# EAGLE schematic ccnor_stm32_v25-sync-unified-mini_panels (EAGLE 6.1)
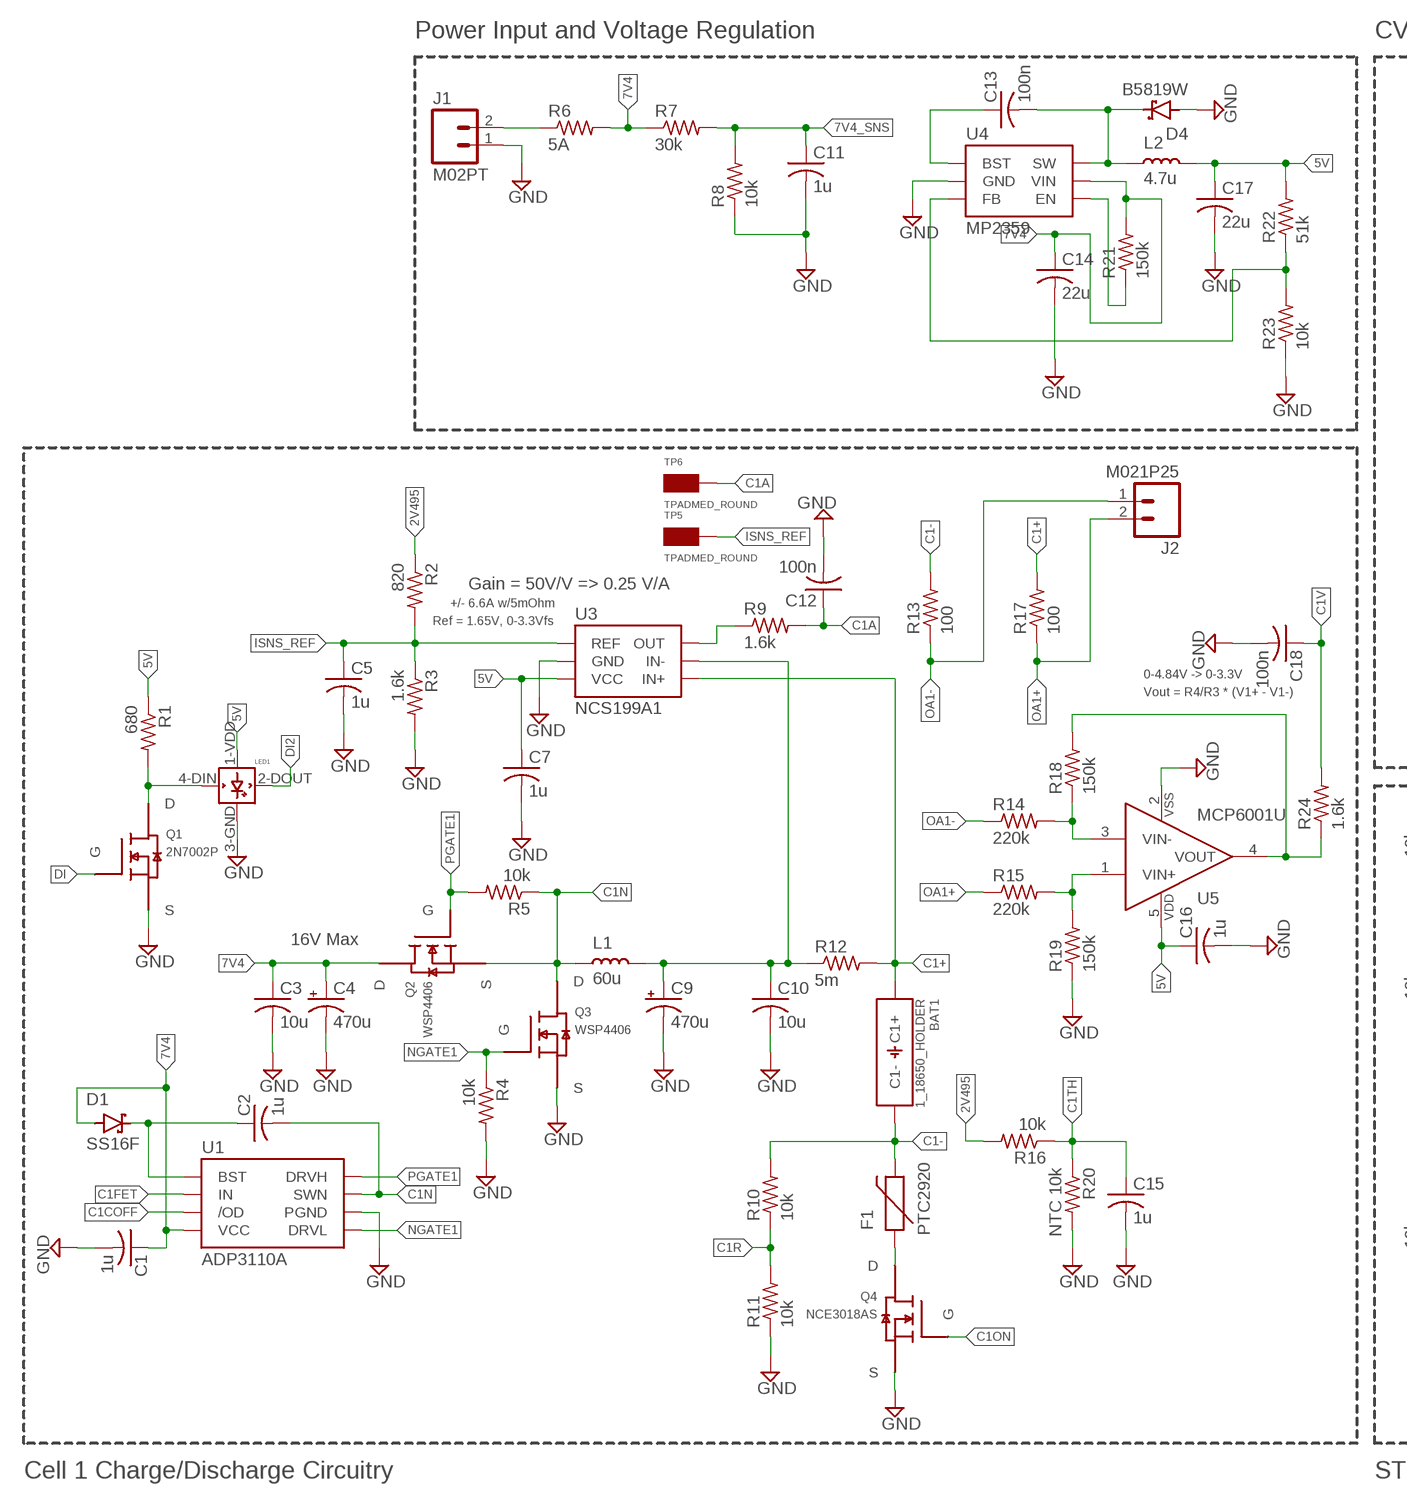
[diagram p0: schematic, sheet 1, part 1 of 3]
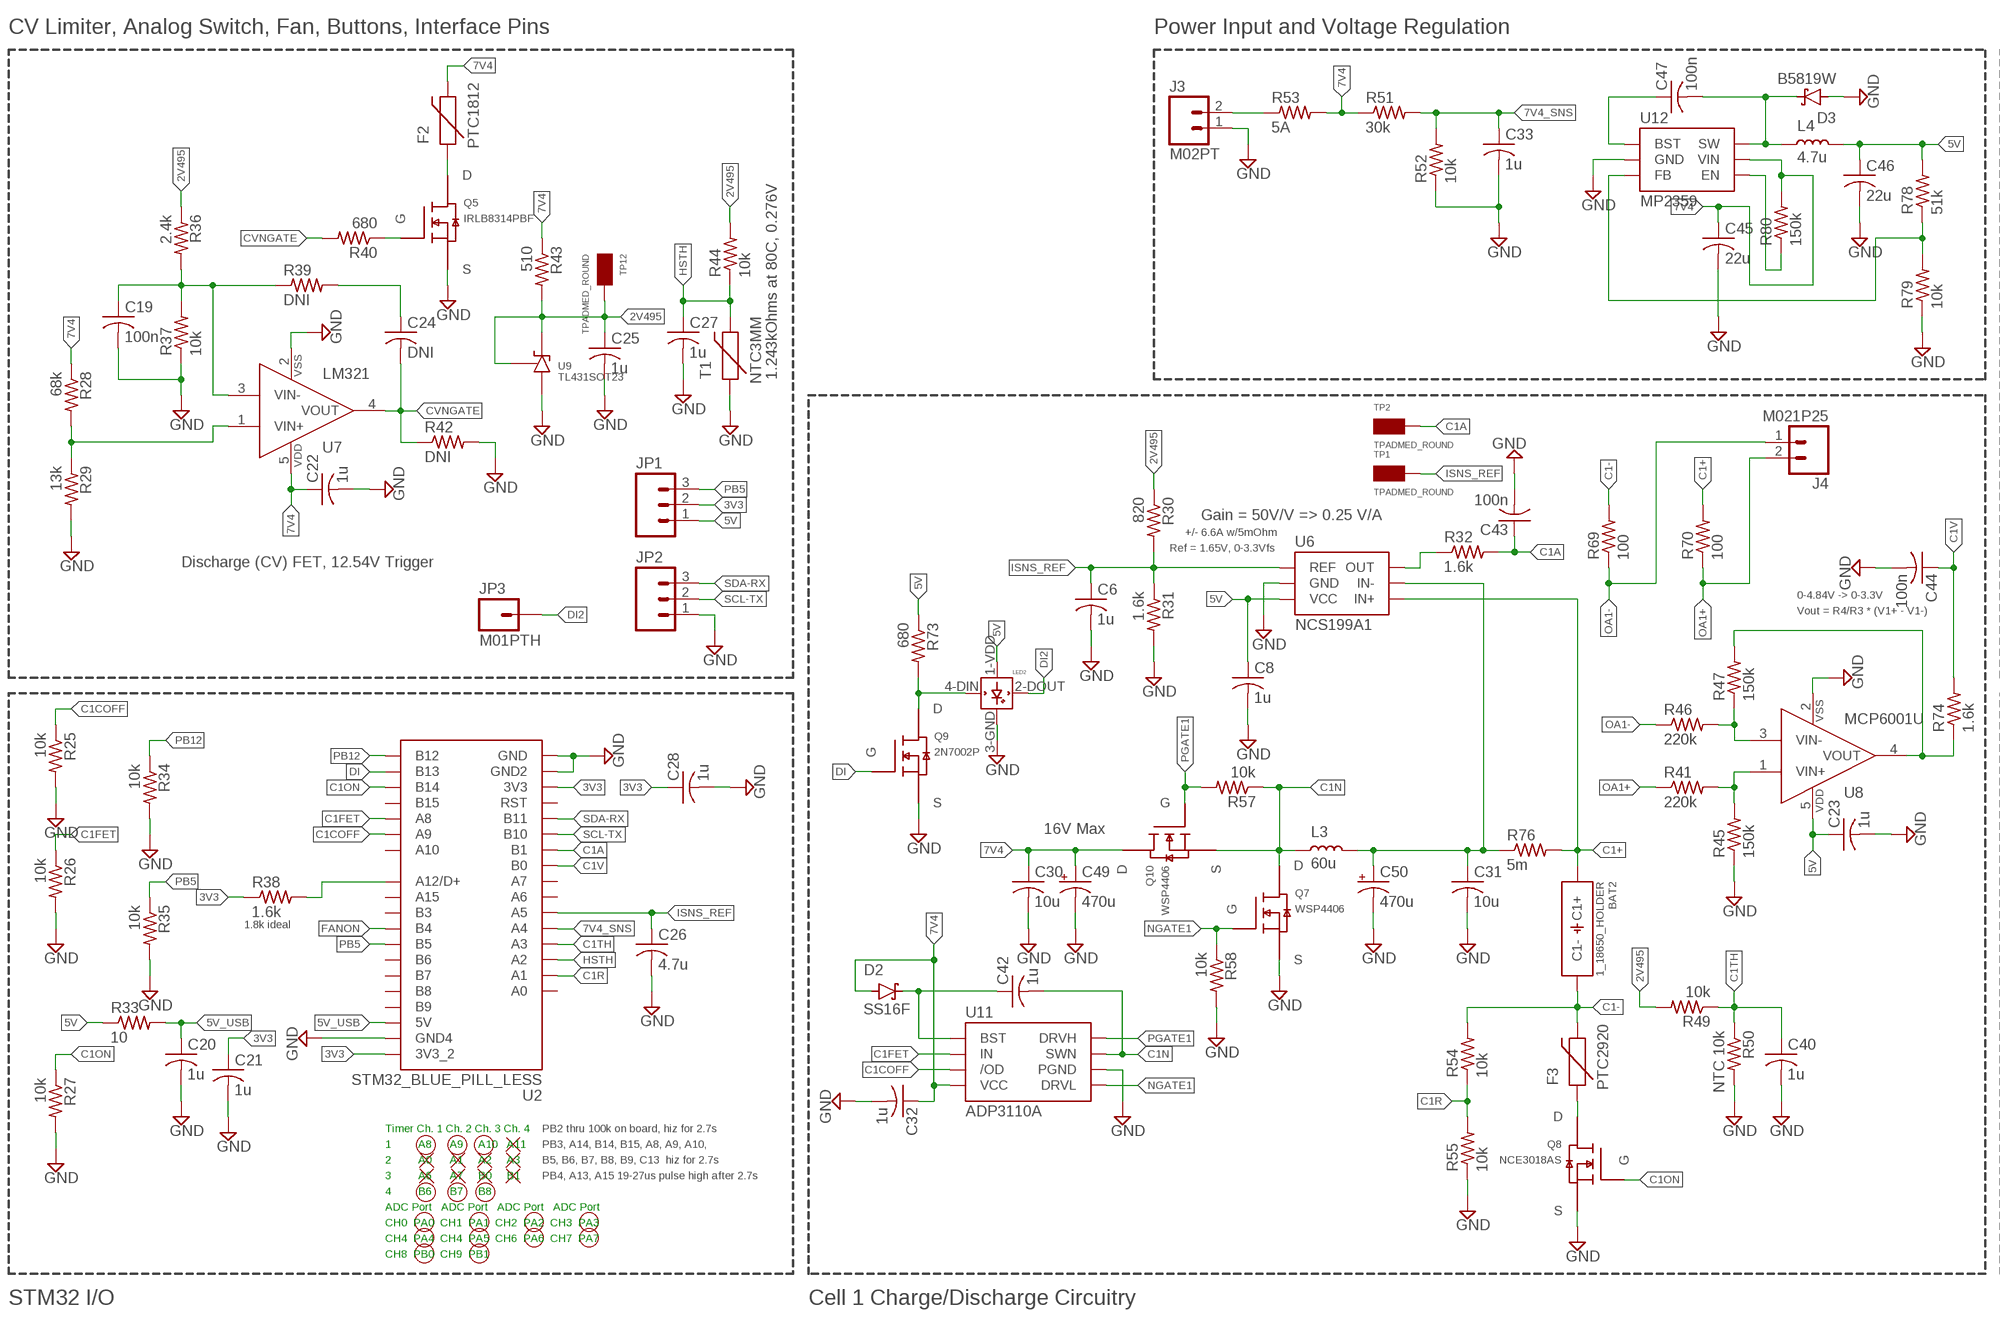
[diagram p1: schematic, sheet 1, part 2 of 3]
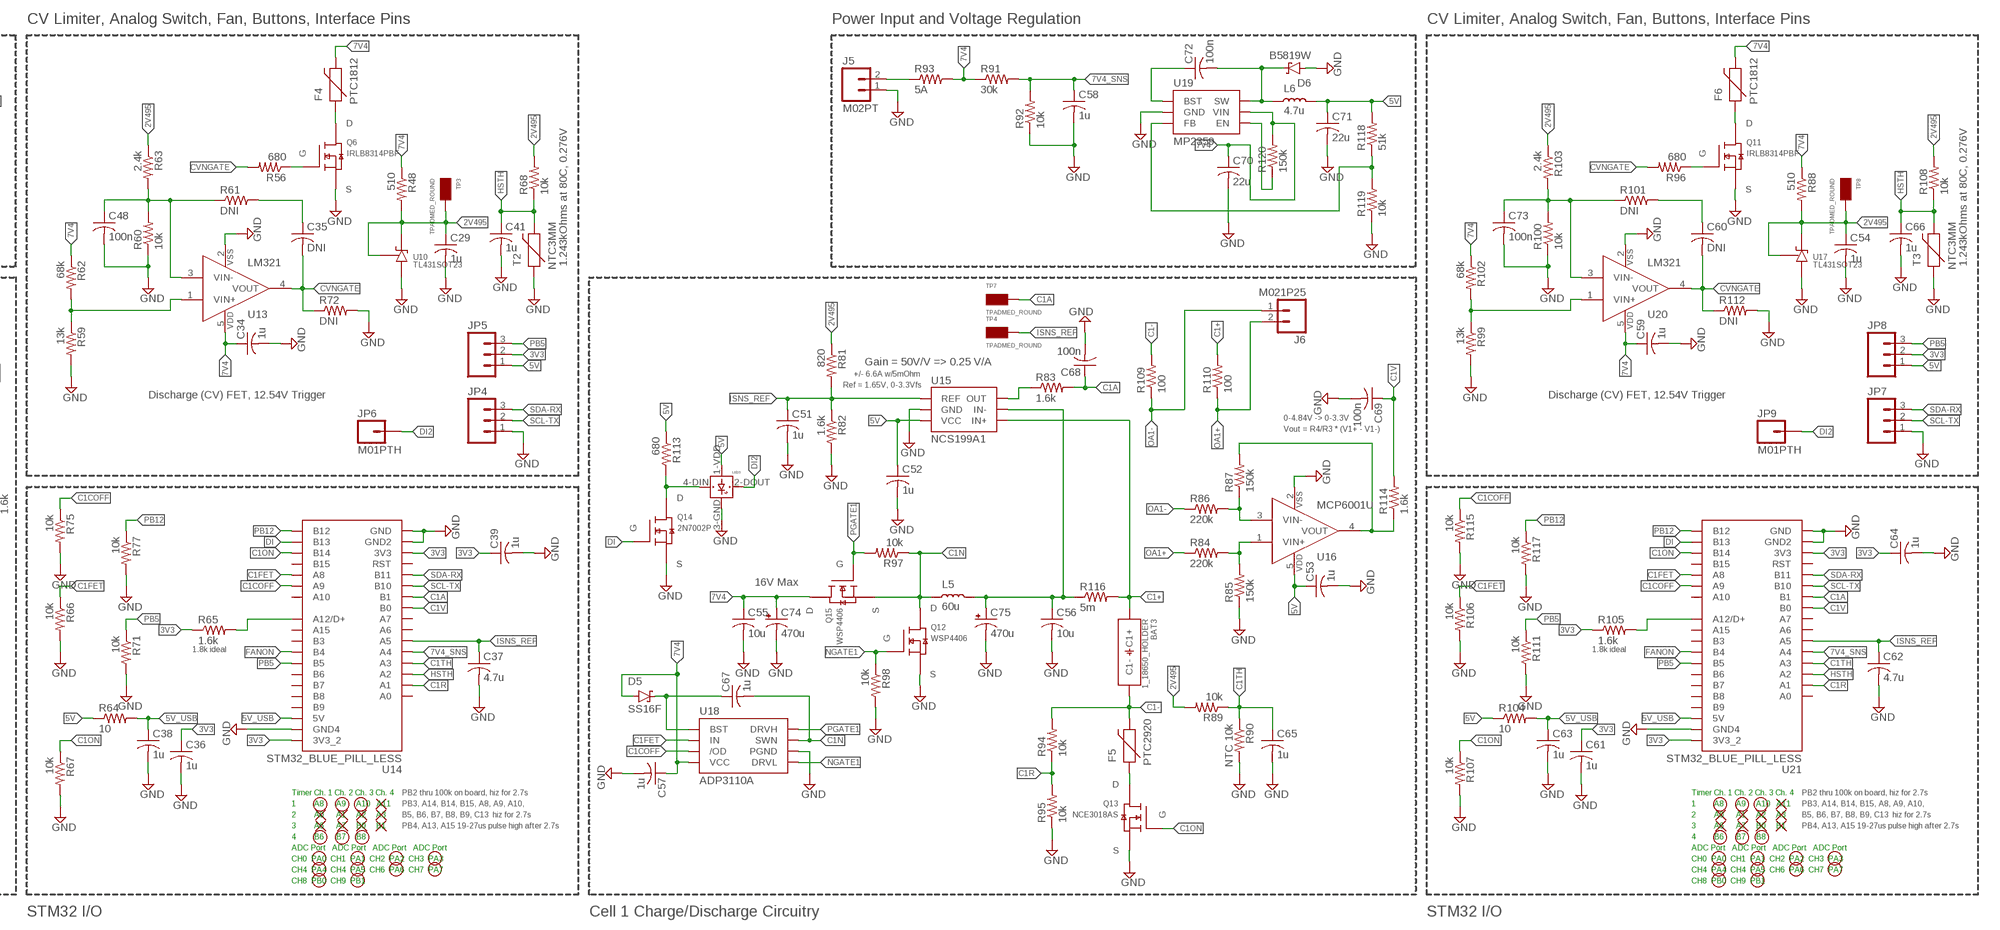
[diagram p2: schematic, sheet 1, part 3 of 3]

## Parts
BAT1  1_18650_HOLDER  [1S_18650_SMD_NH]
BAT2  1_18650_HOLDER  [1S_18650_SMD_NH]
BAT3  1_18650_HOLDER  [1S_18650_SMD_NH]
C1  1u  C-USC0402  [C0402]
C2  1u  C-USC0603  [C0603]
C3  10u  C-USC1206  [C1206]
C4  470u  CPOL-USE2.5-7  [E2,5-7]
C5  1u  C-USC0402  [C0402]
C6  1u  C-USC0402  [C0402]
C7  1u  C-USC0402  [C0402]
C8  1u  C-USC0402  [C0402]
C9  470u  CPOL-USE2.5-7  [E2,5-7]
C10  10u  C-USC1206  [C1206]
C11  1u  C-USC0402  [C0402]
C12  100n  C-USC0402  [C0402]
C13  100n  C-USC0402  [C0402]
C14  22u  C-USC0805  [C0805]
C15  1u  C-USC0402  [C0402]
C16  1u  C-USC0402  [C0402]
C17  22u  C-USC0603  [C0603]
C18  100n  C-USC0402  [C0402]
C19  100n  C-USC0402  [C0402]
C20  1u  C-USC0402  [C0402]
C21  1u  C-USC0402  [C0402]
C22  1u  C-USC0402  [C0402]
C23  1u  C-USC0402  [C0402]
C24  DNI  C-USC0402  [C0402]
C25  1u  C-USC0402  [C0402]
C26  4.7u  C-USC0402  [C0402]
C27  1u  C-USC0402  [C0402]
C28  1u  C-USC0402  [C0402]
C29  1u  C-USC0402  [C0402]
C30  10u  C-USC1206  [C1206]
C31  10u  C-USC1206  [C1206]
C32  1u  C-USC0402  [C0402]
C33  1u  C-USC0402  [C0402]
C34  1u  C-USC0402  [C0402]
C35  DNI  C-USC0402  [C0402]
C36  1u  C-USC0402  [C0402]
C37  4.7u  C-USC0402  [C0402]
C38  1u  C-USC0402  [C0402]
C39  1u  C-USC0402  [C0402]
C40  1u  C-USC0402  [C0402]
C41  1u  C-USC0402  [C0402]
C42  1u  C-USC0603  [C0603]
C43  100n  C-USC0402  [C0402]
C44  100n  C-USC0402  [C0402]
C45  22u  C-USC0805  [C0805]
C46  22u  C-USC0603  [C0603]
C47  100n  C-USC0402  [C0402]
C48  100n  C-USC0402  [C0402]
C49  470u  CPOL-USE2.5-7  [E2,5-7]
C50  470u  CPOL-USE2.5-7  [E2,5-7]
C51  1u  C-USC0402  [C0402]
C52  1u  C-USC0402  [C0402]
C53  1u  C-USC0402  [C0402]
C54  1u  C-USC0402  [C0402]
C55  10u  C-USC1206  [C1206]
C56  10u  C-USC1206  [C1206]
C57  1u  C-USC0402  [C0402]
C58  1u  C-USC0402  [C0402]
C59  1u  C-USC0402  [C0402]
C60  DNI  C-USC0402  [C0402]
C61  1u  C-USC0402  [C0402]
C62  4.7u  C-USC0402  [C0402]
C63  1u  C-USC0402  [C0402]
C64  1u  C-USC0402  [C0402]
C65  1u  C-USC0402  [C0402]
C66  1u  C-USC0402  [C0402]
C67  1u  C-USC0603  [C0603]
C68  100n  C-USC0402  [C0402]
C69  100n  C-USC0402  [C0402]
C70  22u  C-USC0805  [C0805]
C71  22u  C-USC0603  [C0603]
C72  100n  C-USC0402  [C0402]
C73  100n  C-USC0402  [C0402]
C74  470u  CPOL-USE2.5-7  [E2,5-7]
C75  470u  CPOL-USE2.5-7  [E2,5-7]
D1  SS16F  DIODE_SCHOTTKYCDBM140-G  [SOD123]
D2  SS16F  DIODE_SCHOTTKYCDBM140-G  [SOD123]
D3  B5819W  PMEG3020ER  [SOD123W]
D4  B5819W  PMEG3020ER  [SOD123W]
D5  SS16F  DIODE_SCHOTTKYCDBM140-G  [SOD123]
D6  B5819W  PMEG3020ER  [SOD123W]
F1  PTC2920  [2920]
F2  PTC1812  [1812]
F3  PTC2920  [2920]
F4  PTC1812  [1812]
F5  PTC2920  [2920]
F6  PTC1812  [1812]
J1  M02PT  [PHOENIXCONTACT1935161]
J2  M021P25  [M02_1P25MM]
J3  M02PT  [PHOENIXCONTACT1935161]
J4  M021P25  [M02_1P25MM]
J5  M02PT  [PHOENIXCONTACT1935161]
J6  M021P25  [M02_1P25MM]
JP1  M03PTH  [1X03]
JP2  M03PTH  [1X03]
JP3  M01PTH  [1X01]
JP4  M03PTH  [1X03]
JP5  M03PTH  [1X03]
JP6  M01PTH  [1X01]
JP7  M03PTH  [1X03]
JP8  M03PTH  [1X03]
JP9  M01PTH  [1X01]
L1  60u  INDUCTOR10A  [INDUCTOR_10A_8.2MMX21MM]
L2  4.7u  INDUCTOR0805  [0805]
L3  60u  INDUCTOR10A  [INDUCTOR_10A_8.2MMX21MM]
L4  4.7u  INDUCTOR0805  [0805]
L5  60u  INDUCTOR10A  [INDUCTOR_10A_8.2MMX21MM]
L6  4.7u  INDUCTOR0805  [0805]
LED1  WS2812B  [WS2812B]
LED2  WS2812B  [WS2812B]
LED3  WS2812B  [WS2812B]
Q1  2N7002P  [SOT23]
Q2  WSP4406  N-MOSFET-SOIC8  [8-SOIC]
Q3  WSP4406  N-MOSFET-SOIC8  [8-SOIC]
Q4  NCE3018AS  N-MOSFET-SOIC8  [8-SOIC]
Q5  IRLB8314PBF  [TO-220]
Q6  IRLB8314PBF  [TO-220]
Q7  WSP4406  N-MOSFET-SOIC8  [8-SOIC]
Q8  NCE3018AS  N-MOSFET-SOIC8  [8-SOIC]
Q9  2N7002P  [SOT23]
Q10  WSP4406  N-MOSFET-SOIC8  [8-SOIC]
Q11  IRLB8314PBF  [TO-220]
Q12  WSP4406  N-MOSFET-SOIC8  [8-SOIC]
Q13  NCE3018AS  N-MOSFET-SOIC8  [8-SOIC]
Q14  2N7002P  [SOT23]
Q15  WSP4406  N-MOSFET-SOIC8  [8-SOIC]
R1  680  R-US_R0402  [R0402]
R2  820  R-US_R0402  [R0402]
R3  1.6k  R-US_R0402  [R0402]
R4  10k  R-US_R0402  [R0402]
R5  10k  R-US_R0402  [R0402]
R6  5A  R-US_R1206  [R1206]
R7  30k  R-US_R0402  [R0402]
R8  10k  R-US_R0402  [R0402]
R9  1.6k  R-US_R0402  [R0402]
R10  10k  R-US_R0402  [R0402]
R11  10k  R-US_R0402  [R0402]
R12  5m  R-US_R1206  [R1206]
R13  100  R-US_R0402  [R0402]
R14  220k  R-US_R0402  [R0402]
R15  220k  R-US_R0402  [R0402]
R16  10k  R-US_R0402  [R0402]
R17  100  R-US_R0402  [R0402]
R18  150k  R-US_R0402  [R0402]
R19  150k  R-US_R0402  [R0402]
R20  NTC 10k  R-US_R0402  [R0402]
R21  150k  R-US_R0402  [R0402]
R22  51k  R-US_R0402  [R0402]
R23  10k  R-US_R0402  [R0402]
R24  1.6k  R-US_R0402  [R0402]
R25  10k  R-US_R0402  [R0402]
R26  10k  R-US_R0402  [R0402]
R27  10k  R-US_R0402  [R0402]
R28  68k  R-US_R0402  [R0402]
R29  13k  R-US_R0402  [R0402]
R30  820  R-US_R0402  [R0402]
R31  1.6k  R-US_R0402  [R0402]
R32  1.6k  R-US_R0402  [R0402]
R33  10  R-US_R0402  [R0402]
R34  10k  R-US_R0402  [R0402]
R35  10k  R-US_R0402  [R0402]
R36  2.4k  R-US_R0402  [R0402]
R37  10k  R-US_R0402  [R0402]
R38  1.6k  R-US_R0402  [R0402]
R39  DNI  R-US_R0402  [R0402]
R40  680  R-US_R0402  [R0402]
R41  220k  R-US_R0402  [R0402]
R42  DNI  R-US_R0402  [R0402]
R43  510  R-US_R0402  [R0402]
R44  10k  R-US_R0402  [R0402]
R45  150k  R-US_R0402  [R0402]
R46  220k  R-US_R0402  [R0402]
R47  150k  R-US_R0402  [R0402]
R48  510  R-US_R0402  [R0402]
R49  10k  R-US_R0402  [R0402]
R50  NTC 10k  R-US_R0402  [R0402]
R51  30k  R-US_R0402  [R0402]
R52  10k  R-US_R0402  [R0402]
R53  5A  R-US_R1206  [R1206]
R54  10k  R-US_R0402  [R0402]
R55  10k  R-US_R0402  [R0402]
R56  680  R-US_R0402  [R0402]
R57  10k  R-US_R0402  [R0402]
R58  10k  R-US_R0402  [R0402]
R59  13k  R-US_R0402  [R0402]
R60  10k  R-US_R0402  [R0402]
R61  DNI  R-US_R0402  [R0402]
R62  68k  R-US_R0402  [R0402]
R63  2.4k  R-US_R0402  [R0402]
R64  10  R-US_R0402  [R0402]
R65  1.6k  R-US_R0402  [R0402]
R66  10k  R-US_R0402  [R0402]
R67  10k  R-US_R0402  [R0402]
R68  10k  R-US_R0402  [R0402]
R69  100  R-US_R0402  [R0402]
R70  100  R-US_R0402  [R0402]
R71  10k  R-US_R0402  [R0402]
R72  DNI  R-US_R0402  [R0402]
R73  680  R-US_R0402  [R0402]
R74  1.6k  R-US_R0402  [R0402]
R75  10k  R-US_R0402  [R0402]
R76  5m  R-US_R1206  [R1206]
R77  10k  R-US_R0402  [R0402]
R78  51k  R-US_R0402  [R0402]
R79  10k  R-US_R0402  [R0402]
R80  150k  R-US_R0402  [R0402]
R81  820  R-US_R0402  [R0402]
R82  1.6k  R-US_R0402  [R0402]
R83  1.6k  R-US_R0402  [R0402]
R84  220k  R-US_R0402  [R0402]
R85  150k  R-US_R0402  [R0402]
R86  220k  R-US_R0402  [R0402]
R87  150k  R-US_R0402  [R0402]
R88  510  R-US_R0402  [R0402]
R89  10k  R-US_R0402  [R0402]
R90  NTC 10k  R-US_R0402  [R0402]
R91  30k  R-US_R0402  [R0402]
R92  10k  R-US_R0402  [R0402]
R93  5A  R-US_R1206  [R1206]
R94  10k  R-US_R0402  [R0402]
R95  10k  R-US_R0402  [R0402]
R96  680  R-US_R0402  [R0402]
R97  10k  R-US_R0402  [R0402]
R98  10k  R-US_R0402  [R0402]
R99  13k  R-US_R0402  [R0402]
R100  10k  R-US_R0402  [R0402]
R101  DNI  R-US_R0402  [R0402]
R102  68k  R-US_R0402  [R0402]
R103  2.4k  R-US_R0402  [R0402]
R104  10  R-US_R0402  [R0402]
R105  1.6k  R-US_R0402  [R0402]
R106  10k  R-US_R0402  [R0402]
R107  10k  R-US_R0402  [R0402]
R108  10k  R-US_R0402  [R0402]
R109  100  R-US_R0402  [R0402]
R110  100  R-US_R0402  [R0402]
R111  10k  R-US_R0402  [R0402]
R112  DNI  R-US_R0402  [R0402]
R113  680  R-US_R0402  [R0402]
R114  1.6k  R-US_R0402  [R0402]
R115  10k  R-US_R0402  [R0402]
R116  5m  R-US_R1206  [R1206]
R117  10k  R-US_R0402  [R0402]
R118  51k  R-US_R0402  [R0402]
R119  10k  R-US_R0402  [R0402]
R120  150k  R-US_R0402  [R0402]
T1  NTC3MM  PTCNTC3MM  [THERMISTOR_3MMX3MM]
T2  NTC3MM  PTCNTC3MM  [THERMISTOR_3MMX3MM]
T3  NTC3MM  PTCNTC3MM  [THERMISTOR_3MMX3MM]
TP1  TPADMED_ROUND  [TPAD_MED_ROUND]
TP2  TPADMED_ROUND  [TPAD_MED_ROUND]
TP3  TPADMED_ROUND  [TPAD_MED_ROUND]
TP4  TPADMED_ROUND  [TPAD_MED_ROUND]
TP5  TPADMED_ROUND  [TPAD_MED_ROUND]
TP6  TPADMED_ROUND  [TPAD_MED_ROUND]
TP7  TPADMED_ROUND  [TPAD_MED_ROUND]
TP8  TPADMED_ROUND  [TPAD_MED_ROUND]
TP12  TPADMED_ROUND  [TPAD_MED_ROUND]
U1  ADP3110A  [8-SOIC]
U2  STM32_BLUE_PILL_LESS  [STM32_BLUE_PILL_SMD]
U3  NCS199A1  INA214  [SOT-363]
U4  MP2359  JW5052C  [SOT23-6]
U5  MCP6001U  [SOT23-5]
U6  NCS199A1  INA214  [SOT-363]
U7  LM321  [SOT23-5]
U8  MCP6001U  [SOT23-5]
U9  TL431SOT23  [SOT23]
U10  TL431SOT23  [SOT23]
U11  ADP3110A  [8-SOIC]
U12  MP2359  JW5052C  [SOT23-6]
U13  LM321  [SOT23-5]
U14  STM32_BLUE_PILL_LESS  [STM32_BLUE_PILL_SMD]
U15  NCS199A1  INA214  [SOT-363]
U16  MCP6001U  [SOT23-5]
U17  TL431SOT23  [SOT23]
U18  ADP3110A  [8-SOIC]
U19  MP2359  JW5052C  [SOT23-6]
U20  LM321  [SOT23-5]
U21  STM32_BLUE_PILL_LESS  [STM32_BLUE_PILL_SMD]

## Nets
2V495: C25.1 C29.1 C54.1 R2.1 R16.2 R30.1 R36.1 R43.2 R44.2 R48.2 R49.2 R63.1 R68.2 R81.1 R88.2 R89.2 R103.1 R108.2 TP3.1 TP8.1 TP12.1 U9.1(K) U9.2(REF) U10.1(K) U10.2(REF) U17.1(K) U17.2(REF)
3V3: C21.1 C28.1 C36.1 C39.1 C61.1 C64.1 JP1.2 JP5.2 JP8.2 R38.1 R65.1 R105.1 U2.3V3 U2.3V3_2 U14.3V3 U14.3V3_2 U21.3V3 U21.3V3_2
5V: C7.1 C8.1 C16.1 C17.1 C23.1 C46.1 C52.1 C53.1 C71.1 JP1.1 JP5.1 JP8.1 L2.2 L4.2 L6.2 LED1.1-VDD(VDD) LED2.1-VDD(VDD) LED3.1-VDD(VDD) R1.1 R22.2 R33.1 R64.1 R73.1 R78.2 R104.1 R113.1 R118.2 U3.3(VCC) U5.5(VDD) U6.3(VCC) U8.5(VDD) U15.3(VCC) U16.5(VDD)
5V_USB: C20.1 C38.1 C63.1 R33.2 R64.2 R104.2 U2.5V U14.5V U21.5V
7V4: C1.1 C3.1 C4.+ C14.1 C22.1 C30.1 C32.1 C34.1 C45.1 C49.+ C55.1 C57.1 C59.1 C70.1 C74.+ D1.A(ANODE) D2.A(ANODE) D5.A(ANODE) F2.2 F4.2 F6.2 Q2.5(D) Q2.6(D) Q2.7(D) Q2.8(D) Q10.5(D) Q10.6(D) Q10.7(D) Q10.8(D) Q15.5(D) Q15.6(D) Q15.7(D) Q15.8(D) R6.2 R7.1 R21.2 R28.1 R43.1 R48.1 R51.1 R53.2 R62.1 R80.2 R88.1 R91.1 R93.2 R102.1 R120.2 U1.4(VCC) U4.5(VIN) U7.5(VDD) U11.4(VCC) U12.5(VIN) U13.5(VDD) U18.4(VCC) U19.5(VIN) U20.5(VDD)
7V4_SNS: C11.1 C33.1 C58.1 R7.2 R8.2 R51.2 R52.2 R91.2 R92.2 U2.A4 U14.A4 U21.A4
BST: C2.1 D1.K(CATHODE) U1.1(BST)
BST1: C42.1 D2.K(CATHODE) U11.1(BST)
BST2: C67.1 D5.K(CATHODE) U18.1(BST)
BST5V: C13.1 U4.1(BST)
BST5V1: C47.1 U12.1(BST)
BST5V2: C72.1 U19.1(BST)
C1+: BAT1.1+(C1+) BAT2.1+(C1+) BAT3.1+(C1+) R12.2 R17.2 R70.2 R76.2 R110.2 R116.2 U3.4(IN+) U6.4(IN+) U15.4(IN+)
C1-: BAT1.1-(C1-) BAT2.1-(C1-) BAT3.1-(C1-) F1.K F3.K F5.K R10.2 R13.2 R54.2 R69.2 R94.2 R109.2
C1A: C12.1 C43.1 C68.1 R9.2 R32.2 R83.2 TP2.1 TP6.1 TP7.1 U2.B1 U14.B1 U21.B1
C1COFF: R25.1 R75.1 R115.1 U1.3(/OD) U2.A9 U11.3(/OD) U14.A9 U18.3(/OD) U21.A9
C1FET: R26.1 R66.1 R106.1 U1.2(IN) U2.A8 U11.2(IN) U14.A8 U18.2(IN) U21.A8
C1N: C2.2 C42.2 C67.2 L1.P$1 L3.P$1 L5.P$1 Q2.1(S) Q2.2(S) Q2.3(S) Q3.5(D) Q3.6(D) Q3.7(D) Q3.8(D) Q7.5(D) Q7.6(D) Q7.7(D) Q7.8(D) Q10.1(S) Q10.2(S) Q10.3(S) Q12.5(D) Q12.6(D) Q12.7(D) Q12.8(D) Q15.1(S) Q15.2(S) Q15.3(S) R5.1 R57.1 R97.1 U1.7(SWN) U11.7(SWN) U18.7(SWN)
C1ON: Q4.4(G) Q8.4(G) Q13.4(G) R27.1 R67.1 R107.1 U2.B14 U14.B14 U21.B14
C1R: R10.1 R11.2 R54.1 R55.2 R94.1 R95.2 U2.A1 U14.A1 U21.A1
C1TH: C15.1 C40.1 C65.1 R16.1 R20.1 R49.1 R50.1 R89.1 R90.1 U2.A3 U14.A3 U21.A3
C1V: C18.1 C44.1 C69.1 R24.2 R74.2 R114.2 U2.B0 U14.B0 U21.B0
C1V_OA: R18.2 R24.1 U5.4(VOUT)
C1V_OA1: R47.2 R74.1 U8.4(VOUT)
C1V_OA2: R87.2 R114.1 U16.4(VOUT)
C1VFBN: C24.1 R39.2
C1VFBN1: C35.1 R61.2
C1VFBN2: C60.1 R101.2
CVNGATE: C24.2 C35.2 C60.2 R40.2 R42.1 R56.2 R72.1 R96.2 R112.1 U7.4(VOUT) U13.4(VOUT) U20.4(VOUT)
CVOAREF: C19.1 R36.2 R37.2 R39.1 U7.3(VIN-)
CVOAREF1: C48.1 R60.2 R61.1 R63.2 U13.3(VIN-)
CVOAREF2: C73.1 R100.2 R101.1 R103.2 U20.3(VIN-)
CVOASNS: R28.2 R29.1 U7.1(VIN+)
CVOASNS1: R59.1 R62.2 U13.1(VIN+)
CVOASNS2: R99.1 R102.2 U20.1(VIN+)
DI: Q1.1(G) Q9.1(G) Q14.1(G) U2.B13 U14.B13 U21.B13
DI1: LED1.4-DIN(DIN) Q1.3(D) R1.2
DI2: JP3.1 JP6.1 JP9.1 LED1.2-DOUT(DOUT) LED2.2-DOUT(DOUT) LED3.2-DOUT(DOUT)
DI3: LED2.4-DIN(DIN) Q9.3(D) R73.2
DI4: LED3.4-DIN(DIN) Q14.3(D) R113.2
EN5V: R21.1 U4.4(EN)
EN5V1: R80.1 U12.4(EN)
EN5V2: R120.1 U19.4(EN)
FANON: U2.B4 U14.B4 U21.B4
FB5V: R22.1 R23.2 U4.3(FB)
FB5V1: R78.1 R79.2 U12.3(FB)
FB5V2: R118.1 R119.2 U19.3(FB)
GND: C1.2 C3.2 C4.- C5.2 C6.2 C7.2 C8.2 C9.- C10.2 C11.2 C12.2 C14.2 C15.2 C16.2 C17.2 C18.2 C19.2 C20.2 C21.2 C22.2 C23.2 C25.2 C26.2 C27.2 C28.2 C29.2 C30.2 C31.2 C32.2 C33.2 C34.2 C36.2 C37.2 C38.2 C39.2 C40.2 C41.2 C43.2 C44.2 C45.2 C46.2 C48.2 C49.- C50.- C51.2 C52.2 C53.2 C54.2 C55.2 C56.2 C57.2 C58.2 C59.2 C61.2 C62.2 C63.2 C64.2 C65.2 C66.2 C68.2 C69.2 C70.2 C71.2 C73.2 C74.- C75.- D3.A(ANODE) D4.A(ANODE) D6.A(ANODE) J1.1 J3.1 J5.1 JP2.1 JP4.1 JP7.1 LED1.3-GND(GND) LED2.3-GND(GND) LED3.3-GND(GND) Q1.2(S) Q3.1(S) Q3.2(S) Q3.3(S) Q4.1(S) Q4.2(S) Q4.3(S) Q5.3(S) Q6.3(S) Q7.1(S) Q7.2(S) Q7.3(S) Q8.1(S) Q8.2(S) Q8.3(S) Q9.2(S) Q11.3(S) Q12.1(S) Q12.2(S) Q12.3(S) Q13.1(S) Q13.2(S) Q13.3(S) Q14.2(S) R3.2 R4.2 R8.1 R11.1 R19.1 R20.2 R23.1 R25.2 R26.2 R27.2 R29.2 R31.2 R34.2 R35.2 R37.1 R42.2 R45.1 R50.2 R52.1 R55.1 R58.2 R59.2 R60.1 R66.2 R67.2 R71.2 R72.2 R75.2 R77.2 R79.1 R82.2 R85.1 R90.2 R92.1 R95.1 R98.2 R99.2 R100.1 R106.2 R107.2 R111.2 R112.2 R115.2 R117.2 R119.1 T1.1 T2.1 T3.1 U1.6(PGND) U2.GND U2.GND2 U2.GND4 U3.2(GND) U4.2(GND) U5.2(VSS) U6.2(GND) U7.2(VSS) U8.2(VSS) U9.3(A) U10.3(A) U11.6(PGND) U12.2(GND) U13.2(VSS) U14.GND U14.GND2 U14.GND4 U15.2(GND) U16.2(VSS) U17.3(A) U18.6(PGND) U19.2(GND) U20.2(VSS) U21.GND U21.GND2 U21.GND4
HSTH: C27.1 C41.1 C66.1 R44.1 R68.1 R108.1 T1.2 T2.2 T3.2 U2.A2 U14.A2 U21.A2
IN-1: C9.+ C10.1 L1.P$2 R12.1 U3.5(IN-)
IN-2: C31.1 C50.+ L3.P$2 R76.1 U6.5(IN-)
IN-3: C56.1 C75.+ L5.P$2 R116.1 U15.5(IN-)
IS1O: R9.1 U3.6(OUT)
IS1O1: R32.1 U6.6(OUT)
IS1O2: R83.1 U15.6(OUT)
ISNS_REF: C5.1 C6.1 C26.1 C37.1 C51.1 C62.1 R2.2 R3.1 R30.2 R31.1 R81.2 R82.1 TP1.1 TP4.1 TP5.1 U2.A5 U3.1(REF) U6.1(REF) U14.A5 U15.1(REF) U21.A5
N$1: R41.2 R45.2 U8.1(VIN+)
N$2: R46.2 R47.1 U8.3(VIN-)
N$3: R15.2 R19.2 U5.1(VIN+)
N$4: R14.2 R18.1 U5.3(VIN-)
N$5: J3.2 R53.1
N$6: R65.2 U14.A12(A12/D+)
N$7: F3.A Q8.5(D) Q8.6(D) Q8.7(D) Q8.8(D)
N$8: F4.1 Q6.2(D)
N$9: R84.2 R85.2 U16.1(VIN+)
N$10: F2.1 Q5.2(D)
N$11: R86.2 R87.1 U16.3(VIN-)
N$12: J5.2 R93.1
N$13: J1.2 R6.1
N$14: R105.2 U21.A12(A12/D+)
N$15: F5.A Q13.5(D) Q13.6(D) Q13.7(D) Q13.8(D)
N$16: F6.1 Q11.2(D)
N$26: R38.2 U2.A12(A12/D+)
N$32: F1.A Q4.5(D) Q4.6(D) Q4.7(D) Q4.8(D)
NGATE1: Q3.4(G) Q7.4(G) Q12.4(G) R4.1 R58.1 R98.1 U1.5(DRVL) U11.5(DRVL) U18.5(DRVL)
OA1+: J2.2 J4.2 J6.2 R15.1 R17.1 R41.1 R70.1 R84.1 R110.1
OA1-: J2.1 J4.1 J6.1 R13.1 R14.1 R46.1 R69.1 R86.1 R109.1
PB5: JP1.3 JP5.3 JP8.3 R35.1 R71.1 R111.1 U2.B5 U14.B5 U21.B5
PB12: R34.1 R77.1 R117.1 U2.B12 U14.B12 U21.B12
PGATE1: Q2.4(G) Q10.4(G) Q15.4(G) R5.2 R57.2 R97.2 U1.8(DRVH) U11.8(DRVH) U18.8(DRVH)
Q7G: Q5.1(G) R40.1
Q7G1: Q6.1(G) R56.1
Q7G2: Q11.1(G) R96.1
SCL-TX: JP2.2 JP4.2 JP7.2 U2.B10 U14.B10 U21.B10
SDA-RX: JP2.3 JP4.3 JP7.3 U2.B11 U14.B11 U21.B11
SW5V: C13.2 D4.K(CATHODE) L2.1 U4.6(SW)
SW5V1: C47.2 D3.K(CATHODE) L4.1 U12.6(SW)
SW5V2: C72.2 D6.K(CATHODE) L6.1 U19.6(SW)
Unconnected: U2.A0 U2.A6 U2.A7 U2.A10 U2.A15 U2.B3 U2.B6 U2.B7 U2.B8 U2.B9 U2.B15 U2.RST U14.A0 U14.A6 U14.A7 U14.A10 U14.A15 U14.B3 U14.B6 U14.B7 U14.B8 U14.B9 U14.B15 U14.RST U21.A0 U21.A6 U21.A7 U21.A10 U21.A15 U21.B3 U21.B6 U21.B7 U21.B8 U21.B9 U21.B15 U21.RST

## Notes on the sheet
- Power Input and Voltage Regulation | CV Limiter, Analog Switch, Fan, Buttons, Interface Pins | Power Input and Voltage Regulation | CV Limiter, Analog Switch, Fan, Buttons, Interface Pins | Power Input and Voltage Regulation | CV Limiter, Analog Switch, Fan, Buttons, Interface Pins
- 1.243kOhms at 80C, 0.276V | 1.243kOhms at 80C, 0.276V | 1.243kOhms at 80C, 0.276V
- Gain = 50V/V => 0.25 V/A | Gain = 50V/V => 0.25 V/A | Gain = 50V/V => 0.25 V/A
- +/- 6.6A w/5mOhm | +/- 6.6A w/5mOhm | +/- 6.6A w/5mOhm
- Ref = 1.65V, 0-3.3Vfs | Ref = 1.65V, 0-3.3Vfs | Ref = 1.65V, 0-3.3Vfs
- Discharge (CV) FET, 12.54V Trigger | Discharge (CV) FET, 12.54V Trigger | Discharge (CV) FET, 12.54V Trigger
- 0-4.84V -> 0-3.3V | 0-4.84V -> 0-3.3V | 0-4.84V -> 0-3.3V
- Vout = R4/R3 * (V1+ - V1-) | Vout = R4/R3 * (V1+ - V1-) | Vout = R4/R3 * (V1+ - V1-)
- 16V Max | 16V Max | 16V Max
- 1.8k ideal | 1.8k ideal | 1.8k ideal
- Timer Ch. 1 Ch. 2 Ch. 3 Ch. 4 | PB2 thru 100k on board, hiz for 2.7s | Timer Ch. 1 Ch. 2 Ch. 3 Ch. 4 | PB2 thru 100k on board, hiz for 2.7s | Timer Ch. 1 Ch. 2 Ch. 3 Ch. 4 | PB2 thru 100k on board, hiz for 2.7s
- 1         A8      A9     A10   A11 | PB3, A14, B14, B15, A8, A9, A10, | 1         A8      A9     A10   A11 | PB3, A14, B14, B15, A8, A9, A10, | 1         A8      A9     A10   A11 | PB3, A14, B14, B15, A8, A9, A10,
- 2         A0      A1     A2     A3 | B5, B6, B7, B8, B9, C13  hiz for 2.7s | 2         A0      A1     A2     A3 | B5, B6, B7, B8, B9, C13  hiz for 2.7s | 2         A0      A1     A2     A3 | B5, B6, B7, B8, B9, C13  hiz for 2.7s
- 3         A6      A7     B0     B1 | PB4, A13, A15 19-27us pulse high after 2.7s | 3         A6      A7     B0     B1 | PB4, A13, A15 19-27us pulse high after 2.7s | 3         A6      A7     B0     B1 | PB4, A13, A15 19-27us pulse high after 2.7s
- 4         B6      B7     B8 | 4         B6      B7     B8 | 4         B6      B7     B8
- ADC Port   ADC Port   ADC Port   ADC Port | ADC Port   ADC Port   ADC Port   ADC Port | ADC Port   ADC Port   ADC Port   ADC Port
- CH0  PA0  CH1  PA1  CH2  PA2  CH3  PA3 | CH0  PA0  CH1  PA1  CH2  PA2  CH3  PA3 | CH0  PA0  CH1  PA1  CH2  PA2  CH3  PA3
- CH4  PA4  CH4  PA5  CH6  PA6  CH7  PA7 | CH4  PA4  CH4  PA5  CH6  PA6  CH7  PA7 | CH4  PA4  CH4  PA5  CH6  PA6  CH7  PA7
- CH8  PB0  CH9  PB1 | CH8  PB0  CH9  PB1 | CH8  PB0  CH9  PB1
- Cell 1 Charge/Discharge Circuitry | STM32 I/O | Cell 1 Charge/Discharge Circuitry | STM32 I/O | Cell 1 Charge/Discharge Circuitry | STM32 I/O

## Library data of the parts
BAT1-BAT3 = custom:1_18650_HOLDER
C1-C3 C5-C8 C10-C48 C51-C73 = resistor:C-US: CAPACITOR, American symbol
C4 C9 C49 C50 C74 C75 = resistor:CPOL-US: POLARIZED CAPACITOR, American symbol
D1 D2 D5 = custom:DIODE_SCHOTTKY: 40V 1A 500mV @1A
D3 D4 D6 = custom:PMEG3020ER: Schottky Diode 30V 2A 0.42V 1.5mA Leakage
F1-F6 T1-T3 = custom:PTC
J1-J6 = custom:M02: 2-pin Header
JP1 JP2 JP4 JP5 JP7 JP8 = SparkFun:M03: Header 3 Standard 3-pin 0.1" header. Use with straight break away headers (SKU : PRT-00116), right angle break away headers (PRT-00553), swiss pins (PRT-00743), machine pins (PRT-00117), and female headers (PRT-00115). Molex polarized connector foot print use with SKU : PRT-08232 with associated crimp pins and housings.
JP3 JP6 JP9 = SparkFun:M01: Header 1 Standard 1-pin 0.1" header. Use with straight break away headers (SKU : PRT-00116), right angle break away headers (PRT-00553), swiss pins (PRT-00743), machine pins (PRT-00117), and female headers (PRT-00115).
L1-L6 = custom:INDUCTOR
LED1-LED3 = adafruit:WS2812B
Q1 Q9 Q14 = custom:2N7002P: 2N7002P N-channel MOSFET 60V 360mA Logic Level
Q2-Q4 Q7 Q8 Q10 Q12 Q13 Q15 = custom:N-MOSFET-SOIC8
Q5 Q6 Q11 = custom:IRLB8314PBF: MOSFET N-Channel 30V 184A 3.2mOhm @4.5Vgs 125W
R1-R120 = resistor:R-US_: RESISTOR, American symbol
TP1-TP8 TP12 = custom:TPAD
U1 U11 U18 = custom:ADP3110A: MOSFET Driver Dual Bootstrapped 12 V w/Output Disable 3nF 25ns Synchronous
U2 U14 U21 = custom:STM32_BLUE_PILL_LESS
U3 U6 U15 = custom:INA214: Current Shunt Amplifier 30kHz 2.7-26V
U4 U12 U19 = custom:JW5052C: Buck Regulator Synchronous 4.5-18V 2A 700kHz 100uA 120mOhm
U5 U8 U16 = custom:MCP6001: Op-Amp Single Rail-to-Rail 1MHz
U7 U13 U20 = custom:LM321: Op-Amp Low Power Single 3-32V Vcm 0-(Vcc-1.5) Vo 0.02-(Vcc-2)
U9 U10 U17 = custom:TL431: Shunt Voltage Reference IC 700uA 100mA 36V